# Altium schematic sheet E150_Laser.SchDoc
size A3; PageSetup: Record=PageOptions|CenterHorizontal=True|CenterVertical=True|PrintScale=1.00|XCorrection=1.00|YCorrection=1.00|PrintKind=2|BorderSize=5000000|LeftOffset=0|BottomOffset=0|Orientation=2|PaperLength=1000|PaperWidth=1000|Scale=100|PaperSource=7|PrintQuality=-4|MediaType=1|DitherType=10|PaperKind=A3|PrintScaleMode=1
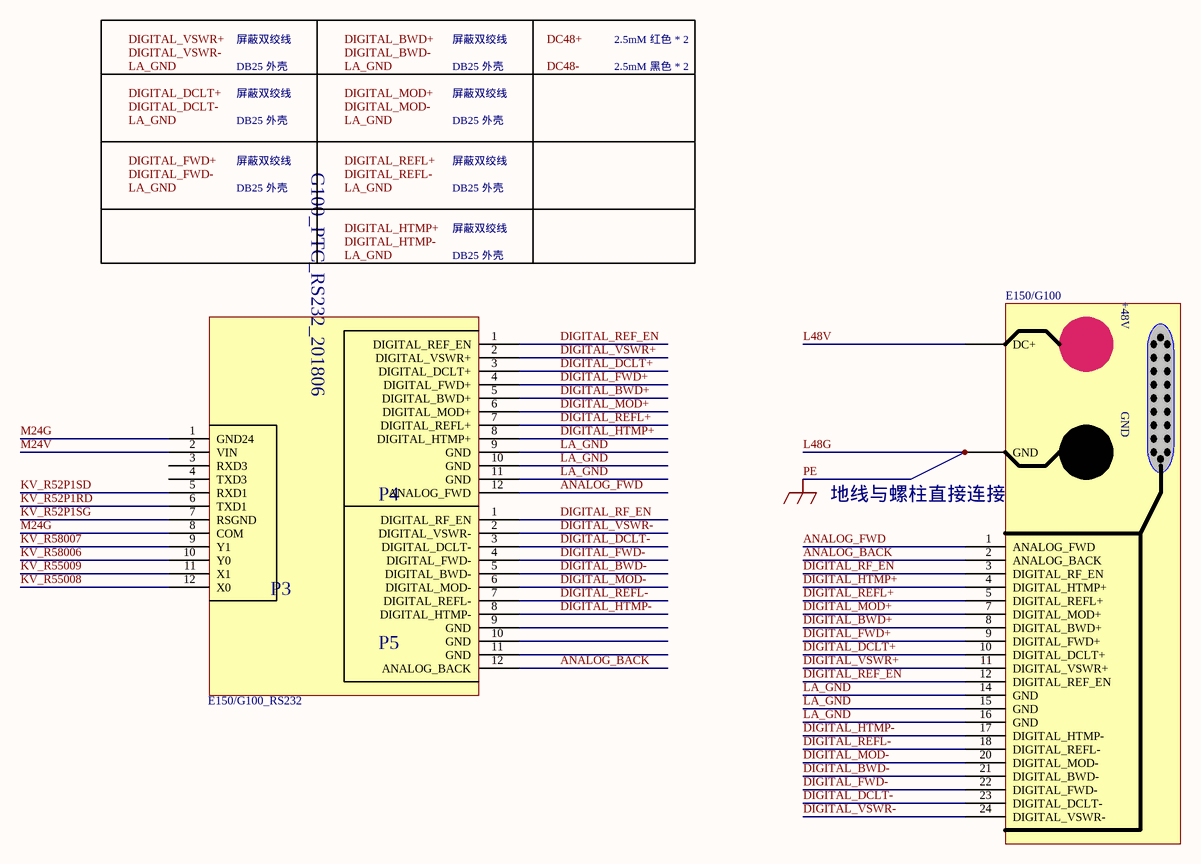
[diagram p0: E150_Laser.SchDoc]

## Parts
(Parts that share a designator on the sheet are numbered #1, #2 ... from top to bottom, then left to right.)
*#1  E150/G100
*#2  E150/G100_RS232

## Nets
L48G: *#1.1(GND)  [also labelled PE]
ANALOG_BACK: *#1.2(ANALOG_BACK) *#2.12(ANALOG_BACK)
ANALOG_FWD: *#1.1(ANALOG_FWD) *#2.12(ANALOG_FWD)
DIGITAL_BWD+: *#1.8(DIGITAL_BWD+) *#2.5(DIGITAL_BWD+)
DIGITAL_BWD-: *#1.21(DIGITAL_BWD-) *#2.5(DIGITAL_BWD-)
DIGITAL_DCLT+: *#1.10(DIGITAL_DCLT+) *#2.3(RXD3)
DIGITAL_DCLT-: *#1.23(DIGITAL_DCLT-) *#2.3(DIGITAL_DCLT-)
DIGITAL_FWD+: *#1.9(DIGITAL_FWD+) *#2.4(TXD3)
DIGITAL_FWD-: *#1.22(DIGITAL_FWD-) *#2.4(DIGITAL_FWD-)
DIGITAL_HTMP+: *#1.4(DIGITAL_HTMP+) *#2.8(DIGITAL_HTMP+)
DIGITAL_HTMP-: *#1.17(DIGITAL_HTMP-) *#2.8(DIGITAL_HTMP-)
DIGITAL_MOD+: *#1.7(DIGITAL_MOD+) *#2.6(DIGITAL_MOD+)
DIGITAL_MOD-: *#1.20(DIGITAL_MOD-) *#2.6(DIGITAL_MOD-)
DIGITAL_REF_EN: *#1.12(DIGITAL_REF_EN) *#2.1(DIGITAL_REF_EN)
DIGITAL_REFL+: *#1.5(DIGITAL_REFL+) *#2.7(DIGITAL_REFL+)
DIGITAL_REFL-: *#1.18(DIGITAL_REFL-) *#2.7(DIGITAL_REFL-)
DIGITAL_RF_EN: *#1.3(DIGITAL_RF_EN) *#2.1(DIGITAL_RF_EN)
DIGITAL_VSWR+: *#1.11(DIGITAL_VSWR+) *#2.2(DIGITAL_VSWR+)
DIGITAL_VSWR-: *#1.24(DIGITAL_VSWR-) *#2.2(DIGITAL_VSWR-)
KV_R52P1RD: *#2.6(TXD1)
KV_R52P1SD: *#2.5(RXD1)
KV_R52P1SG: *#2.7(RSGND)
KV_R55008: *#2.12(X0)
KV_R55009: *#2.11(X1)
KV_R58006: *#2.10(Y0)
KV_R58007: *#2.9(Y1)
L48V: *#1.0(DC+)
LA_GND: *#1.14(GND) *#1.15(GND) *#1.16(GND) *#2.9(GND) *#2.10(GND) *#2.11(GND)
M24G: *#2.1(GND24) *#2.8(COM)
M24V: *#2.2(VIN)

## Notes on the sheet
- 屏蔽双绞线
- 2.5mM 红色 * 2
- DB25 外壳
- 2.5mM 黑色 * 2
- 地线与螺柱直接连接
- Labels drawn without touching a wire or pin: DC48+, DC48-, DIGITAL_BWD+, DIGITAL_BWD-, DIGITAL_DCLT+, DIGITAL_DCLT-, DIGITAL_FWD+, DIGITAL_FWD-, DIGITAL_HTMP+, DIGITAL_HTMP-, DIGITAL_MOD+, DIGITAL_MOD-, DIGITAL_REFL+, DIGITAL_REFL-, DIGITAL_VSWR+, DIGITAL_VSWR-, LA_GND
- (in symbol E150/G100) +48V
- (in symbol E150/G100_RS232) G100_PTC_RS232_201806; P4; P3; P5